# Altium schematic sheet BV10011_ControlController.SchDoc: Microcontroller
size A3; SheetNumber: 5; SheetTotal: 6
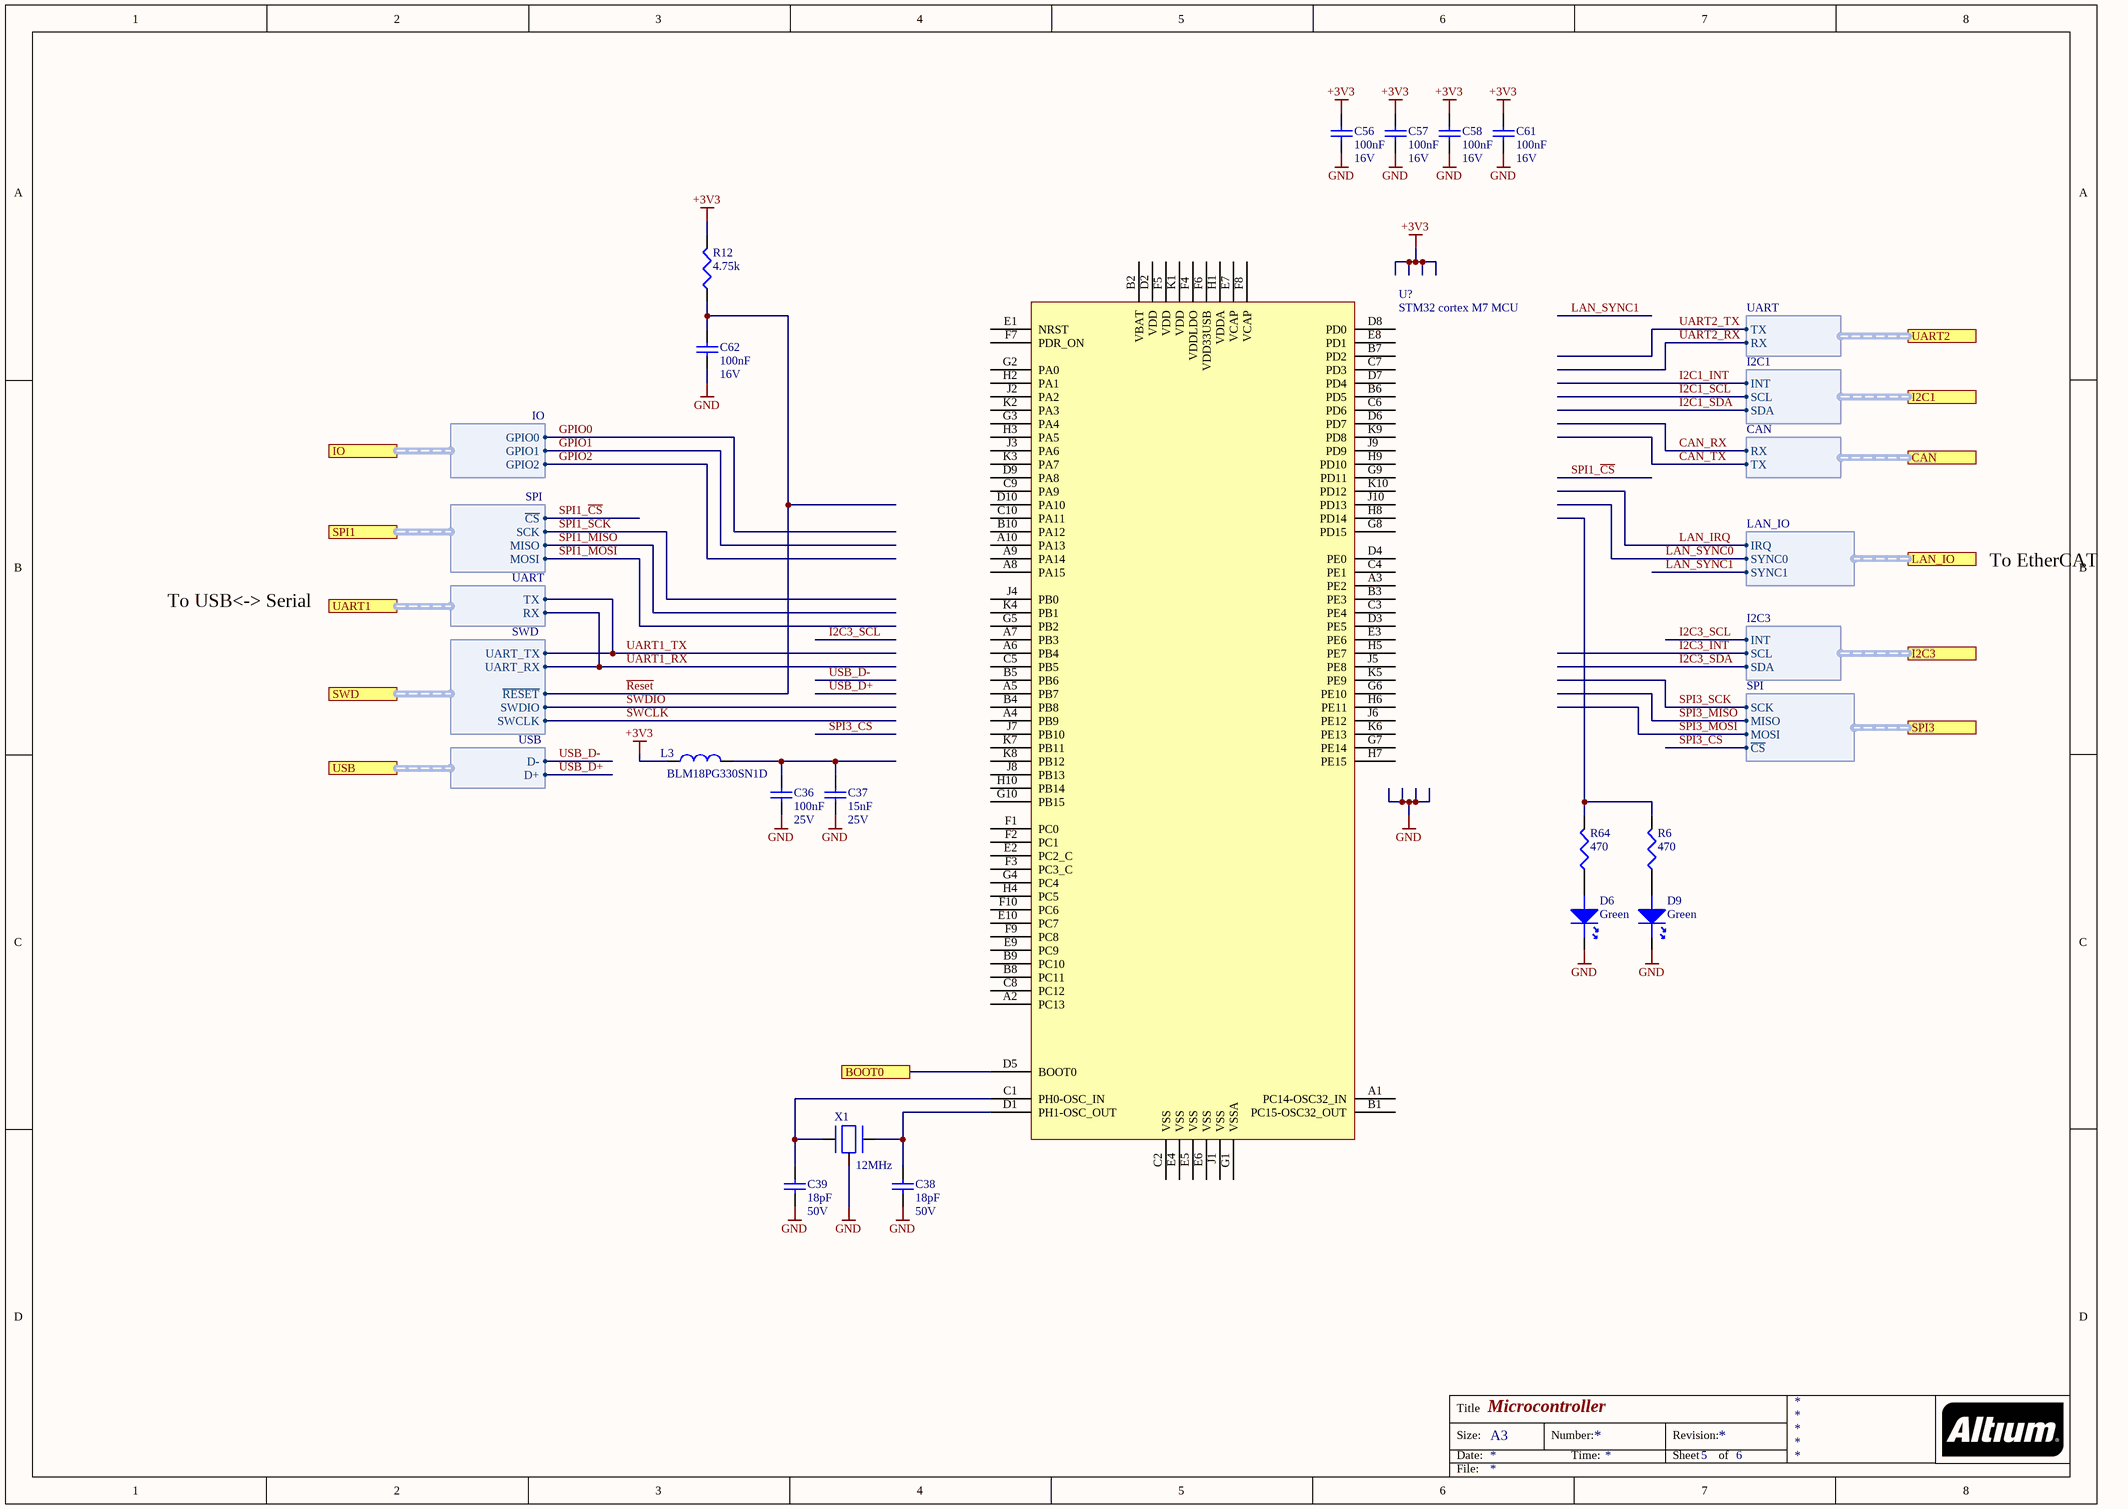
[diagram p0: BV10011_ControlController.SchDoc]

## Parts
C36  100nF  Voltage Rating: 25V  [C0402]
C37  15nF  Voltage Rating: 25V  [C0402]
C38  18pF  Voltage Rating: 50V  [C0402]
C39  18pF  Voltage Rating: 50V  [C0402]
C56  100nF  Voltage Rating: 16V  [C0402]
C57  100nF  Voltage Rating: 16V  [C0402]
C58  100nF  Voltage Rating: 16V  [C0402]
C61  100nF  Voltage Rating: 16V  [C0402]
C62  100nF  Voltage Rating: 16V  [C0402]
D6  Green  [D-0805]
D9  Green  [D-0805]
L3  BLM18PG330SN1D  [L0603]
R6  470  [0402]
R12  4.75k  [0402]
R64  470  [0402]
U?  STM32 cortex M7 MCU  [BGA100C80P10X10_800X800X110]
X1  12MHz  [7M]

## Ports
BOOT0, CAN (harness CAN), I2C1 (harness I2C1), I2C3 (harness I2C3), IO (harness IO), LAN_IO (harness LAN_IO), SPI1 (harness SPI), SPI3 (harness SPI), SWD (harness SWD), UART1 (harness UART), UART2 (harness UART), USB (harness USB)

## Harnesses
SWD: UART_TX, UART_RX, SWDIO, SWCLK, ~{RESET}
SPI: SCK, ~{CS}, MOSI, MISO
LAN_IO: IRQ, SYNC0, SYNC1
UART: TX, RX
USB: D-, D+
CAN: TX, RX
I2C1: INT, SCL, SDA
IO: GPIO0, GPIO1, GPIO2
I2C3: INT, SCL, SDA

## Nets
+3V3: C56.2 C57.2 C58.2 C61.2 L3.2 R12.2
GND: C36.1 C37.1 C38.1 C39.1 C56.1 C57.1 C58.1 C61.1 C62.1 D6.K D9.K X1.0
BOOT0: U?.D5(BOOT0) ; port BOOT0
CAN_RX: port CAN.RX
CAN_TX: port CAN.TX
GPIO0: port IO.GPIO0
GPIO1: port IO.GPIO1
GPIO2: port IO.GPIO2
I2C1_INT: port I2C1.INT
I2C1_SCL: port I2C1.SCL
I2C1_SDA: port I2C1.SDA
I2C3_INT: port I2C3.SCL
I2C3_SCL: port I2C3.INT
I2C3_SDA: port I2C3.SDA
LAN_IRQ: port LAN_IO.IRQ
LAN_SYNC0: port LAN_IO.SYNC0
LAN_SYNC1: port LAN_IO.SYNC1
~{Reset}: C62.2 R12.1 ; port SWD.~{RESET}
SPI1_~{CS}: port SPI1.~{CS}
SPI1_MISO: port SPI1.MISO
SPI1_MOSI: port SPI1.MOSI
SPI1_SCK: port SPI1.SCK
SPI3_~{CS}: port SPI3.~{CS}
SPI3_MISO: port SPI3.MISO
SPI3_MOSI: port SPI3.MOSI
SPI3_SCK: port SPI3.SCK
SWCLK: port SWD.SWCLK
SWDIO: port SWD.SWDIO
UART1_RX: port SWD.UART_RX, port UART1.RX
UART1_TX: port SWD.UART_TX, port UART1.TX
UART2_RX: port UART2.RX
UART2_TX: port UART2.TX
USB_D+: port USB.D+
USB_D-: port USB.D-
NetC36_2: C36.2 C37.2 L3.1
NetC38_2: C38.2 U?.D1(PH1-OSC_OUT) X1.1
NetC39_2: C39.2 U?.C1(PH0-OSC_IN) X1.2
NetD6_A: D6.A R64.1
NetD9_A: D9.A R6.1
NetR6_2: R6.2 R64.2

Not connected (* = marked no-connect by the designer): U? A1(PC14-OSC32_IN) A2(PC13) A3(PE2) A4(PB9) A5(PB7) A6(PB4) A7(PB3) A8(PA15) A9(PA14) A10(PA13) B1(PC15-OSC32_OUT) B2(VBAT) B3(PE3) B4(PB8) B5(PB6) B6(PD5) B7(PD2) B8(PC11) B9(PC10) B10(PA12) C2(VSS) C3(PE4) C4(PE1) C5(PB5) C6(PD6) C7(PD3) C8(PC12) C9(PA9) C10(PA11) D2(VDD) D3(PE5) D4(PE0) D6(PD7) D7(PD4) D8(PD0) D9(PA8) D10(PA10) E1(NRST) E2(PC2_C) E3(PE6) E4(VSS) E5(VSS) E6(VSS) E7(VCAP) E8(PD1) E9(PC9) E10(PC7) F1(PC0) F2(PC1) F3(PC3_C) F4(VDDLDO) F5(VDD) F6(VDD33USB) F7(PDR_ON) F8(VCAP) F9(PC8) F10(PC6) G1(VSSA) G2(PA0) G3(PA4) G4(PC4) G5(PB2) G6(PE10) G7(PE14) G8(PD15) G9(PD11) G10(PB15) H1(VDDA) H2(PA1) H3(PA5) H4(PC5) H5(PE7) H6(PE11) H7(PE15) H8(PD14) H9(PD10) H10(PB14) J1(VSS) J2(PA2) J3(PA6) J4(PB0) J5(PE8) J6(PE12) J7(PB10) J8(PB13) J9(PD9) J10(PD13) K1(VDD) K2(PA3) K3(PA7) K4(PB1) K5(PE9) K6(PE13) K7(PB11) K8(PB12) K9(PD8) K10(PD12)

## Notes on the sheet
- To EtherCAT
- To USB<-> Serial
- Title
- Size:
- Date:
- A3
- Number:
- Time:
- Revision:
- Sheet
- of
- File:

## Library data of the parts
C36 = 100nF/0402/CER/25V: Capacitor, 100nF, 25V, X7R; Capacitance Tolerance: 10nF; Capacitor Case Style: 0402; Brand Number: GRM155R71E104KE14D; Brand: MULTICOMP; Dielectric Characteristic: X7R; Capacitance: 100nF; Temperature Range: -55 to +125 C; Price: 0,0225; Order Code Supplier: 2456106; Supplier: Farnell
C37 = 15nF/0402/CER/25V: Capacitor, 15nF, 25V, X7R; Capacitance Tolerance: +/-10%; Capacitor Case Style: 0402; Brand Number: GRM155R71E153KA61D; Brand: Murata; Dielectric Characteristic: X7R; Capacitance: 15nF; Temperature Range: -55°C to 125°C; Price: 0,0267; Order Code Supplier: 2470470; Supplier: Farnell
C38 C39 = 18pF/0402/CER/50V: Capacitor, 18pF, 50V, NP0; Capacitance Tolerance: ± 5%; Capacitor Case Style: 0402; Brand Number: GRM1555C1H180JA01D; Brand: MURATA; Dielectric Characteristic: NP0; Capacitance: 18pF; Temperature Range: -55°C to 125°C; Price: 0,0177; Order Code Supplier: 1828876; Supplier: Farnell
C56-C58 C61 C62 = 100nF/0402/CER/16V: Capacitor, 100nF, 16V, X7R; Capacitance Tolerance: 10nF; Capacitor Case Style: 0402; Brand Number: GRM155R71C104KA88D; Brand: MURATA; Dielectric Characteristic: X7R; Capacitance: 100nF; Temperature Range: -55 to +125 C; Price: 0,001; Order Code Supplier: 2408523; Supplier: Farnell
D6 D9 = KP-2012SGC: Led, Green, Li:12mcd, Vf:2.2V, If:0.02A; Brand: KingBright; Case Style: 0805; Forward Current: 0.02A; Forward Voltage: 2.2V; Luminous Intensity: 12mcd; Brand Number: KP-2012SGC; Order Code Supplier: 1318243; Price: 0,06; Supplier: Farnell; Temperature Range: -30°C to +85°C
L3 = BLM18PG330SN1D: Ferrite Bead, Impedance:33ohm, DC Resistance Max:0.025ohm, DC Current Rating:3A; Brand: MURATA; Case Style: 0603; Brand Number: BLM18PG330SN1D; Price: 0,048; Supplier: Farnell; Order Code Supplier: 1515742
R6 R64 = 470/0402/0063W/50V: Resistor, 470, 1%, 0.0625W, 50V, 100PPM, 0402; Brand: VISHAY DRALORIC; Brand Number: CRG0402F470R; Power Rating: 0.063W; Case Style: 0402; Order Code Supplier: 2331533; Price: 0,0099; Resistance: 470; Supplier: Farnell; Temperature Coefficient: ± 100PPM; Temperature Range: -55°C to +125°C; Voltage Rating: 50V
R12 = 4.75k/0402/0063W/50V: Resistor, 4.75k, 0.1%, 0.0625W, 50V, 100PPM, 0402; Brand: VISHAY DRALORIC; Brand Number: CRCW04024K75FKED; Power Rating: 0.063W; Case Style: 0402; Order Code Supplier: 2121689; Price: 0,0006; Resistance: 4.75k; Supplier: Farnell; Temperature Coefficient: ± 100PPM; Temperature Range: -55°C to +125°C; Voltage Rating: 50V
U? = STM32H753VIH6
X1 = 7M-12.000MAAJ-T: CRYSTAL, 12MHz,18PF CL, 3.2X2.5MM SMT; Brand: TXC; Order Code Supplier: 1842056; Price: 1,45; Supplier: Farnell; Brand Number: 7M-12.000MAAJ-T